# Altium schematic sheet Sheet2.SchDoc
size 209 x 297 mm; Scale: 1:1; Номер листа: 2; Общее количество листов: 2; Разраб.: Косяков Д.; Пров.: Гюльмалиев Э.; Утв.: Гюльмалиев Э.; Масштаб: 1:1; Наименование изделия 1: Плата управления LED куба; Наименование изделия 2: Схема электрическая; Наименование изделия 3: принципиальная; Нач. отд.: Науч.рук.; Фамилия нач. отд.: Гюльмалиев Э.
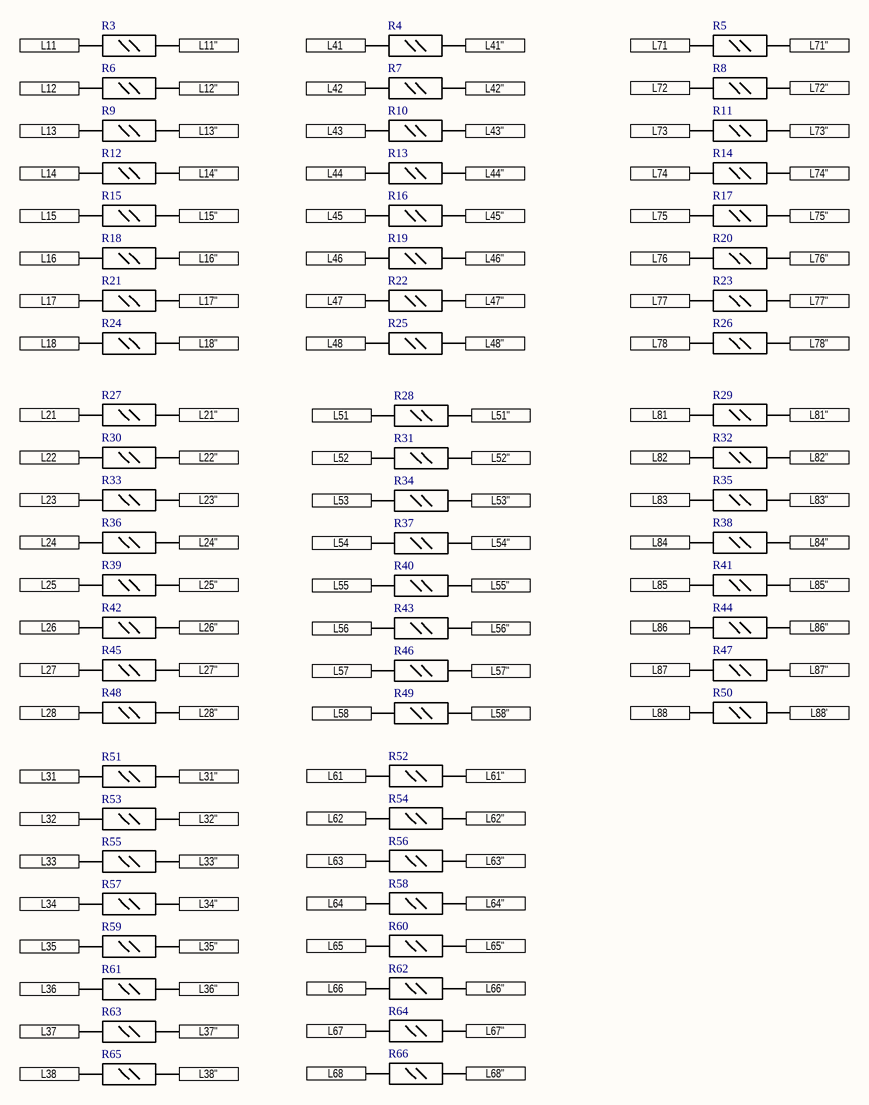
[diagram p0: Sheet2.SchDoc]

## Parts
R3  Резистор 0805  [RESC2113X06N]  (value not drawn)
R4  Резистор 0805  [RESC2113X06N]  (value not drawn)
R5  Резистор 0805  [RESC2113X06N]  (value not drawn)
R6  Резистор 0805  [RESC2113X06N]  (value not drawn)
R7  Резистор 0805  [RESC2113X06N]  (value not drawn)
R8  Резистор 0805  [RESC2113X06N]  (value not drawn)
R9  Резистор 0805  [RESC2113X06N]  (value not drawn)
R10  Резистор 0805  [RESC2113X06N]  (value not drawn)
R11  Резистор 0805  [RESC2113X06N]  (value not drawn)
R12  Резистор 0805  [RESC2113X06N]  (value not drawn)
R13  Резистор 0805  [RESC2113X06N]  (value not drawn)
R14  Резистор 0805  [RESC2113X06N]  (value not drawn)
R15  Резистор 0805  [RESC2113X06N]  (value not drawn)
R16  Резистор 0805  [RESC2113X06N]  (value not drawn)
R17  Резистор 0805  [RESC2113X06N]  (value not drawn)
R18  Резистор 0805  [RESC2113X06N]  (value not drawn)
R19  Резистор 0805  [RESC2113X06N]  (value not drawn)
R20  Резистор 0805  [RESC2113X06N]  (value not drawn)
R21  Резистор 0805  [RESC2113X06N]  (value not drawn)
R22  Резистор 0805  [RESC2113X06N]  (value not drawn)
R23  Резистор 0805  [RESC2113X06N]  (value not drawn)
R24  Резистор 0805  [RESC2113X06N]  (value not drawn)
R25  Резистор 0805  [RESC2113X06N]  (value not drawn)
R26  Резистор 0805  [RESC2113X06N]  (value not drawn)
R27  Резистор 0805  [RESC2113X06N]  (value not drawn)
R28  Резистор 0805  [RESC2113X06N]  (value not drawn)
R29  Резистор 0805  [RESC2113X06N]  (value not drawn)
R30  Резистор 0805  [RESC2113X06N]  (value not drawn)
R31  Резистор 0805  [RESC2113X06N]  (value not drawn)
R32  Резистор 0805  [RESC2113X06N]  (value not drawn)
R33  Резистор 0805  [RESC2113X06N]  (value not drawn)
R34  Резистор 0805  [RESC2113X06N]  (value not drawn)
R35  Резистор 0805  [RESC2113X06N]  (value not drawn)
R36  Резистор 0805  [RESC2113X06N]  (value not drawn)
R37  Резистор 0805  [RESC2113X06N]  (value not drawn)
R38  Резистор 0805  [RESC2113X06N]  (value not drawn)
R39  Резистор 0805  [RESC2113X06N]  (value not drawn)
R40  Резистор 0805  [RESC2113X06N]  (value not drawn)
R41  Резистор 0805  [RESC2113X06N]  (value not drawn)
R42  Резистор 0805  [RESC2113X06N]  (value not drawn)
R43  Резистор 0805  [RESC2113X06N]  (value not drawn)
R44  Резистор 0805  [RESC2113X06N]  (value not drawn)
R45  Резистор 0805  [RESC2113X06N]  (value not drawn)
R46  Резистор 0805  [RESC2113X06N]  (value not drawn)
R47  Резистор 0805  [RESC2113X06N]  (value not drawn)
R48  Резистор 0805  [RESC2113X06N]  (value not drawn)
R49  Резистор 0805  [RESC2113X06N]  (value not drawn)
R50  Резистор 0805  [RESC2113X06N]  (value not drawn)
R51  Резистор 0805  [RESC2113X06N]  (value not drawn)
R52  Резистор 0805  [RESC2113X06N]  (value not drawn)
R53  Резистор 0805  [RESC2113X06N]  (value not drawn)
R54  Резистор 0805  [RESC2113X06N]  (value not drawn)
R55  Резистор 0805  [RESC2113X06N]  (value not drawn)
R56  Резистор 0805  [RESC2113X06N]  (value not drawn)
R57  Резистор 0805  [RESC2113X06N]  (value not drawn)
R58  Резистор 0805  [RESC2113X06N]  (value not drawn)
R59  Резистор 0805  [RESC2113X06N]  (value not drawn)
R60  Резистор 0805  [RESC2113X06N]  (value not drawn)
R61  Резистор 0805  [RESC2113X06N]  (value not drawn)
R62  Резистор 0805  [RESC2113X06N]  (value not drawn)
R63  Резистор 0805  [RESC2113X06N]  (value not drawn)
R64  Резистор 0805  [RESC2113X06N]  (value not drawn)
R65  Резистор 0805  [RESC2113X06N]  (value not drawn)
R66  Резистор 0805  [RESC2113X06N]  (value not drawn)

## Ports
L11, L11", L12, L12", L13, L13", L14, L14", L15, L15", L16, L16", L17, L17", L18, L18", L21, L21", L22, L22", L23, L23", L24, L24", L25, L25", L26, L26", L27, L27", L28, L28", L31, L31", L32, L32", L33, L33", L34, L34", L35, L35", L36, L36", L37, L37", L38, L38", L41, L41", L42, L42", L43, L43", L44, L44", L45, L45", L46, L46", L47, L47", L48, L48", L51, L51", L52, L52", L53, L53", L54, L54", L55, L55", L56, L56", L57, L57", L58, L58", L61, L61", L62, L62", L63, L63", L64, L64", L65, L65", L66, L66", L67, L67", L68, L68", L71, L71", L72, L72", L73, L73", L74, L74", L75, L75", L76, L76", L77, L77", L78, L78", L81, L81", L82, L82", L83, L83", L84, L84", L85, L85", L86, L86", L87, L87", L88, L88'

## Nets
L11: R3.1 ; port L11
L11": R3.2 ; port L11"
L12: R6.1 ; port L12
L12": R6.2 ; port L12"
L13: R9.1 ; port L13
L13": R9.2 ; port L13"
L14: R12.1 ; port L14
L14": R12.2 ; port L14"
L15: R15.1 ; port L15
L15": R15.2 ; port L15"
L16: R18.1 ; port L16
L16": R18.2 ; port L16"
L17: R21.1 ; port L17
L17": R21.2 ; port L17"
L18: R24.1 ; port L18
L18": R24.2 ; port L18"
L21: R27.1 ; port L21
L21": R27.2 ; port L21"
L22: R30.1 ; port L22
L22": R30.2 ; port L22"
L23: R33.1 ; port L23
L23": R33.2 ; port L23"
L24: R36.1 ; port L24
L24": R36.2 ; port L24"
L25: R39.1 ; port L25
L25": R39.2 ; port L25"
L26: R42.1 ; port L26
L26": R42.2 ; port L26"
L27: R45.1 ; port L27
L27": R45.2 ; port L27"
L28: R48.1 ; port L28
L28": R48.2 ; port L28"
L31: R51.1 ; port L31
L31": R51.2 ; port L31"
L32: R53.1 ; port L32
L32": R53.2 ; port L32"
L33: R55.1 ; port L33
L33": R55.2 ; port L33"
L34: R57.1 ; port L34
L34": R57.2 ; port L34"
L35: R59.1 ; port L35
L35": R59.2 ; port L35"
L36: R61.1 ; port L36
L36": R61.2 ; port L36"
L37: R63.1 ; port L37
L37": R63.2 ; port L37"
L38: R65.1 ; port L38
L38": R65.2 ; port L38"
L41: R4.1 ; port L41
L41": R4.2 ; port L41"
L42: R7.1 ; port L42
L42": R7.2 ; port L42"
L43: R10.1 ; port L43
L43": R10.2 ; port L43"
L44: R13.1 ; port L44
L44": R13.2 ; port L44"
L45: R16.1 ; port L45
L45": R16.2 ; port L45"
L46: R19.1 ; port L46
L46": R19.2 ; port L46"
L47: R22.1 ; port L47
L47": R22.2 ; port L47"
L48: R25.1 ; port L48
L48": R25.2 ; port L48"
L51: R28.1 ; port L51
L51": R28.2 ; port L51"
L52: R31.1 ; port L52
L52": R31.2 ; port L52"
L53: R34.1 ; port L53
L53": R34.2 ; port L53"
L54: R37.1 ; port L54
L54": R37.2 ; port L54"
L55: R40.1 ; port L55
L55": R40.2 ; port L55"
L56: R43.1 ; port L56
L56": R43.2 ; port L56"
L57: R46.1 ; port L57
L57": R46.2 ; port L57"
L58: R49.1 ; port L58
L58": R49.2 ; port L58"
L61: R52.1 ; port L61
L61": R52.2 ; port L61"
L62: R54.1 ; port L62
L62": R54.2 ; port L62"
L63: R56.1 ; port L63
L63": R56.2 ; port L63"
L64: R58.1 ; port L64
L64": R58.2 ; port L64"
L65: R60.1 ; port L65
L65": R60.2 ; port L65"
L66: R62.1 ; port L66
L66": R62.2 ; port L66"
L67: R64.1 ; port L67
L67": R64.2 ; port L67"
L68: R66.1 ; port L68
L68": R66.2 ; port L68"
L71: R5.1 ; port L71
L71": R5.2 ; port L71"
L72: R8.1 ; port L72
L72": R8.2 ; port L72"
L73: R11.1 ; port L73
L73": R11.2 ; port L73"
L74: R14.1 ; port L74
L74": R14.2 ; port L74"
L75: R17.1 ; port L75
L75": R17.2 ; port L75"
L76: R20.1 ; port L76
L76": R20.2 ; port L76"
L77: R23.1 ; port L77
L77": R23.2 ; port L77"
L78: R26.1 ; port L78
L78": R26.2 ; port L78"
L81: R29.1 ; port L81
L81": R29.2 ; port L81"
L82: R32.1 ; port L82
L82": R32.2 ; port L82"
L83: R35.1 ; port L83
L83": R35.2 ; port L83"
L84: R38.1 ; port L84
L84": R38.2 ; port L84"
L85: R41.1 ; port L85
L85": R41.2 ; port L85"
L86: R44.1 ; port L86
L86": R44.2 ; port L86"
L87: R47.1 ; port L87
L87": R47.2 ; port L87"
L88: R50.1 ; port L88
L88': R50.2 ; port L88'

## Notes on the sheet
- Перв. примен.
- Справ. №
- Подп. и дата
- Инв. № дубл.
- Взам. инв. №
- Разраб.
- Изм.
- Лист
- № докум.
- Подп.
- Дата
- Лит.
- Масса
- Масштаб
- Пров.
- Т.контр.
- Листов
- Инв. № подл.
- Утв.
- Н.контр.
- Копировал
- Формат А4